# Altium schematic sheet STSPIN32F0A ESC3.SchDoc
size A3
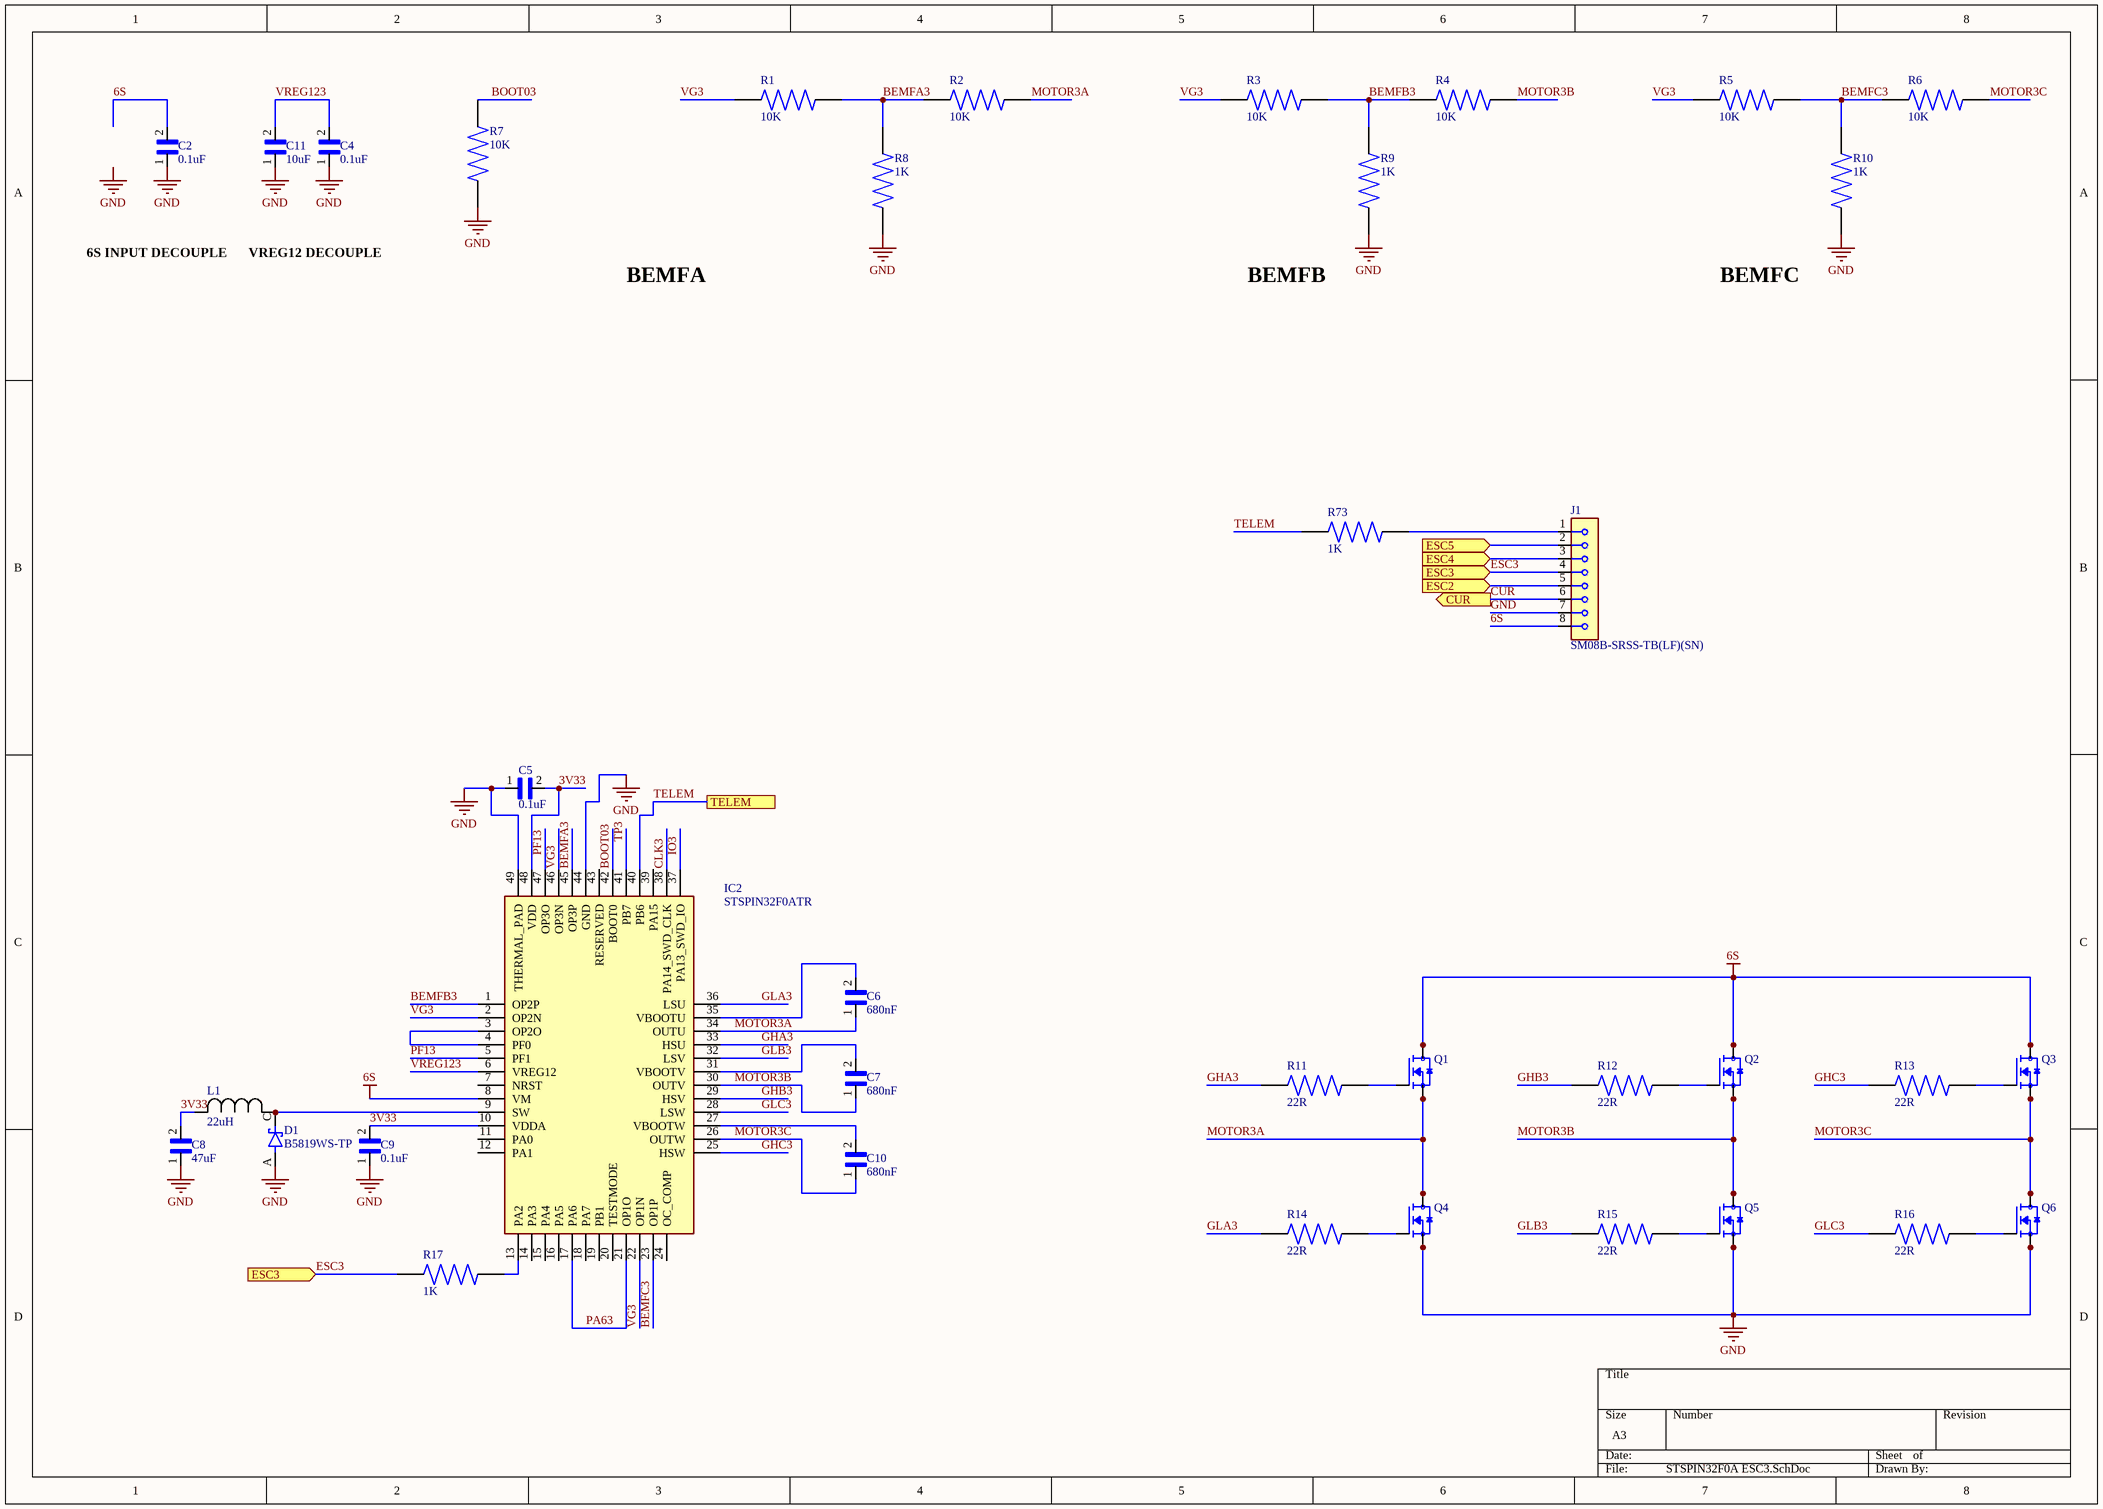
[diagram p0: STSPIN32F0A ESC3.SchDoc]

## Parts
C2  0.1uF  [CAPC1005X55N]
C4  0.1uF  [CAPC1005X55N]
C5  0.1uF  [CAPC1005X55N]
C6  680nF  [CAPC1005X55N]
C7  680nF  [CAPC1005X55N]
C8  47uF  [CAPC1608X90N]
C9  0.1uF  [CAPC1005X55N]
C10  680nF  [CAPC1005X55N]
C11  10uF  [CAPC1608X90N]
D1  B5819WS-TP  [SOD2512X115N]
IC2  STSPIN32F0ATR  [QFN50P700X700X100-49N-D]
J1  SM08B-SRSS-TB(LF)(SN)  [JST_SM08B-SRSS-TB(LF)(SN)]
L1  22uH  [IND_BOURNS_SRN3015]
Q1  TPHR8504PL,L1Q  [TRANS_TPHR8504PL,L1Q]  (value not drawn)
Q2  TPHR8504PL,L1Q  [TRANS_TPHR8504PL,L1Q]  (value not drawn)
Q3  TPHR8504PL,L1Q  [TRANS_TPHR8504PL,L1Q]  (value not drawn)
Q4  TPHR8504PL,L1Q  [TRANS_TPHR8504PL,L1Q]  (value not drawn)
Q5  TPHR8504PL,L1Q  [TRANS_TPHR8504PL,L1Q]  (value not drawn)
Q6  TPHR8504PL,L1Q  [TRANS_TPHR8504PL,L1Q]  (value not drawn)
R1  10K  [RESC1005X37N]
R2  10K  [RESC1005X37N]
R3  10K  [RESC1005X37N]
R4  10K  [RESC1005X37N]
R5  10K  [RESC1005X37N]
R6  10K  [RESC1005X37N]
R7  10K  [RESC1005X37N]
R8  1K  [RESC1005X37N]
R9  1K  [RESC1005X37N]
R10  1K  [RESC1005X37N]
R11  22R  [RESC1005X37N]
R12  22R  [RESC1005X37N]
R13  22R  [RESC1005X37N]
R14  22R  [RESC1005X37N]
R15  22R  [RESC1005X37N]
R16  22R  [RESC1005X37N]
R17  1K  [RESC1005X37N]
R73  1K  [RESC1005X37N]

## Ports
CUR (out), ESC2 (in), ESC3 (in), ESC4 (in), ESC5 (in), TELEM

## Nets
6S: C2.2 IC2.8(VM) J1.8 Q1.5(D) Q1.6(D) Q1.7(D) Q1.8(D) Q1.9(D) Q2.5(D) Q2.6(D) Q2.7(D) Q2.8(D) Q2.9(D) Q3.5(D) Q3.6(D) Q3.7(D) Q3.8(D) Q3.9(D)
GND: C2.1 C4.1 C5.1 C8.1 C9.1 C11.1 D1.A IC2.44(GND) IC2.49(THERMAL_PAD) J1.7 Q4.1(S) Q4.2(S) Q4.3(S) Q5.1(S) Q5.2(S) Q5.3(S) Q6.1(S) Q6.2(S) Q6.3(S) R7.1 R8.2 R9.2 R10.2
3V33: C5.2 C8.2 C9.2 IC2.10(VDDA) IC2.48(VDD) L1.2
BEMFA3: IC2.45(OP3P) R1.1 R2.2 R8.1
BEMFB3: IC2.1(OP2P) R3.1 R4.2 R9.1
BEMFC3: IC2.23(OP1P) R5.1 R6.2 R10.1
BOOT03: IC2.42(BOOT0) R7.2
CLK3: IC2.38(PA14_SWD_CLK)
CUR: J1.6 ; port CUR
ESC2: J1.5 ; port ESC2
ESC3: J1.4 R17.1 ; port ESC3
ESC4: J1.3 ; port ESC4
ESC5: J1.2 ; port ESC5
GHA3: IC2.33(HSU) R11.2
GHB3: IC2.29(HSV) R12.2
GHC3: IC2.25(HSW) R13.2
GLA3: IC2.36(LSU) R14.2
GLB3: IC2.32(LSV) R15.2
GLC3: IC2.28(LSW) R16.2
IO3: IC2.37(PA13_SWD_IO)
MOTOR3A: C6.1 IC2.34(OUTU) Q1.1(S) Q1.2(S) Q1.3(S) Q4.5(D) Q4.6(D) Q4.7(D) Q4.8(D) Q4.9(D) R2.1
MOTOR3B: C7.1 IC2.30(OUTV) Q2.1(S) Q2.2(S) Q2.3(S) Q5.5(D) Q5.6(D) Q5.7(D) Q5.8(D) Q5.9(D) R4.1
MOTOR3C: C10.1 IC2.26(OUTW) Q3.1(S) Q3.2(S) Q3.3(S) Q6.5(D) Q6.6(D) Q6.7(D) Q6.8(D) Q6.9(D) R6.1
PA63: IC2.17(PA6) IC2.21(OP1O)
PF13: IC2.5(PF1) IC2.47(OP3O)
TELEM: IC2.40(PB6) R73.1 ; port TELEM
TP3: IC2.41(PB7)
VG3: IC2.2(OP2N) IC2.22(OP1N) IC2.46(OP3N) R1.2 R3.2 R5.2
VREG123: C4.2 C11.2 IC2.6(VREG12)
NetC6_2: C6.2 IC2.35(VBOOTU)
NetC7_2: C7.2 IC2.31(VBOOTV)
NetC10_2: C10.2 IC2.27(VBOOTW)
NetD1_C: D1.C(K) IC2.9(SW) L1.1
NetIC2_3: IC2.3(OP2O) IC2.4(PF0)
NetIC2_13: IC2.13(PA2) R17.2
NetJ1_1: J1.1 R73.2
NetQ1_4: Q1.4(G) R11.1
NetQ2_4: Q2.4(G) R12.1
NetQ3_4: Q3.4(G) R13.1
NetQ4_4: Q4.4(G) R14.1
NetQ5_4: Q5.4(G) R15.1
NetQ6_4: Q6.4(G) R16.1

Not connected (* = marked no-connect by the designer): IC2 7(NRST) 11(PA0) 12(PA1) 14(PA3) 15(PA4) 16(PA5) 18(PA7) 19(PB1) 20(TESTMODE) 24(OC_COMP) 39(PA15) 43(RESERVED)

## Notes on the sheet
- 6S INPUT DECOUPLE
- VREG12 DECOUPLE
- BEMFA
- BEMFB
- BEMFC
- Labels drawn without touching a wire or pin: GND

## Library data of the parts
C2 C4-C7 C9 C10 = GRM1555C1H222JA01D: Package: None; Price: None; Value: *; MP: GRM1555C1H222JA01D; Availability: Unavailable
C8 C11 = GRM188R71E224JA88D: SMD Capacitor X7R(EIA) with Capacitance: 0.22uF Tol. 5%. Rated Voltage: 25Vdc; Package: None; Price: None; Value: *; MP: GRM188R71E224JA88D; Availability: Unavailable
D1 = B5819WS-TP: MF: {'manufacturer': u'Micro Commercial Components'}; Package: None; MP: B5819WS-TP; Price: None; Availability: Unavailable; Value: *
IC2 = STSPIN32F0ATR: Integrated Circuit; Manufacturer_Name: STMicroelectronics; Datasheet Link: http://www.st.com/content/ccc/resource/technical/document/datasheet/group3/3d/88/0f/d1/3f/0c/49/80/DM00406030/files/DM00406030.pdf/jcr:content/translations/en.DM00406030.pdf; Height: 1mm; Manufacturer_Part_Number: STSPIN32F0ATR; Mouser Part Number: 511-STSPIN32F0ATR; Mouser Price/Stock: https://www.mouser.co.uk/ProductDetail/STMicroelectronics/STSPIN32F0ATR?qs=1mbolxNpo8flc7yUpKWOVQ%3D%3D; Arrow Part Number: STSPIN32F0ATR; Arrow Price/Stock: https://www.arrow.com/en/products/stspin32f0atr/stmicroelectronics
J1 = SM08B-SRSS-TB(LF)(SN): SH Series 8 Position 1 mm Pitch Surface Mount Side Entry Shrouded Header; Price: None; MP: SM08B-SRSS-TB(LF)(SN); Availability: Unavailable; Value: *; Package: None
L1 = SRN3015-220M: No Description Available; Mfr_Name: Bourns Electronics; Type: DEV; Copyright: Copyright (C) 2022 Ultra Librarian. All rights reserved.; Manufacturer_Part_Number: SRN3015-220M; Digi-Key_Part_Number_1: SRN3015-220MCT-ND; Digi-Key_Part_Number_2: SRN3015-220MDKR-ND; Digi-Key_Part_Number_3: SRN3015-220MTR-ND; RefDes: RefDes
Q1-Q6 = TPHR8504PL,L1Q: N-Channel 40V 150A (Tc) 1W (Ta), 170W (Tc) Surface Mount 8-SOP Advance (5x5); MF: Toshiba Semiconductor; Package: SOP-8 Toshiba; Price: None; Value: *; MP: TPHR8504PL,L1Q; SnapEDA_Link: https://www.snapeda.com/parts/TPHR8504PL,L1Q/Toshiba%20Semiconductor%20and%20Storage/view-part/604439/?ref=snap; Availability: Unavailable
R1-R17 R73 = RE0402BRE07330KL: MF: {'manufacturer': u'Yageo'}; Availability: Unavailable; Package: None; MP: RE0402BRE07330KL; Value: *; Price: None